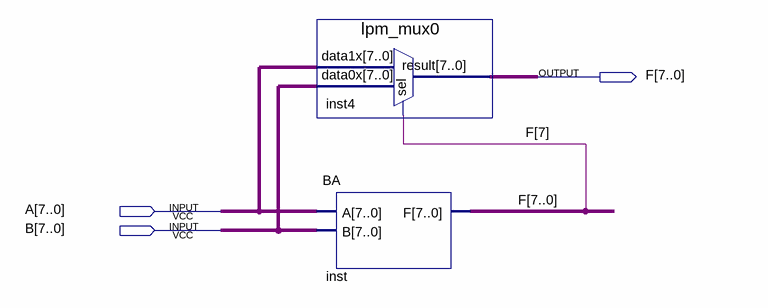
[diagram p0: schematic sheet]
// Quartus schematic MIN.bdf as structural Verilog: 2 symbols, 3 pins
module MIN (
  input  [7:0] A,
  input  [7:0] B,
  output [7:0] F
);

  lpm_mux0 inst4 (.data1x(A), .data0x(B), .sel(F[7]), .result(F));
  BA inst (.A(A), .B(B), .F(F));
endmodule
